# Altium schematic sheet remote.SchDoc
size A
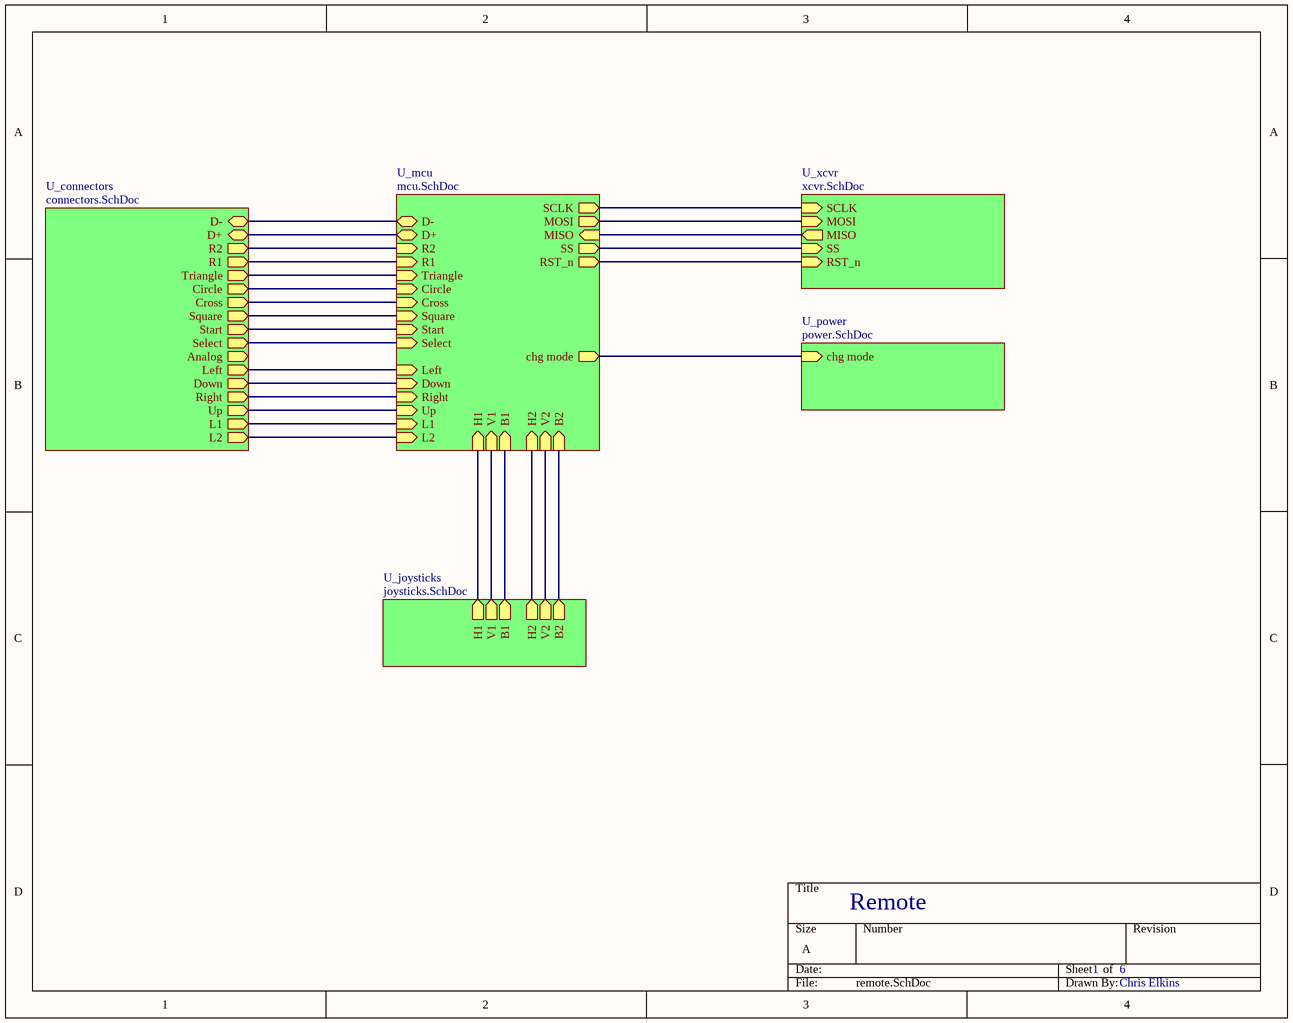
[diagram p0: remote.SchDoc]

## Sub-sheets
U_connectors = connectors.SchDoc: D- (bidir), D+ (bidir), R2, R1, Triangle, Circle, Cross, Square, Start, Select, Analog, Left, Down, Right, Up, L1, L2
U_joysticks = joysticks.SchDoc: H1 (out), V1 (out), B1 (out), H2 (out), V2 (out), B2 (out)
U_mcu = mcu.SchDoc: SCLK (out), MOSI (out), MISO (in), SS (out), D- (bidir), D+ (bidir), chg mode (out), R2 (in), R1 (in), Triangle (in), Circle (in), Cross (in), Square (in), Start (in), Select (in), RST_n (out), Left (in), Down (in), Right (in), Up (in), L1 (in), L2 (in), H1 (in), V1 (in), B1 (in), H2 (in), V2 (in), B2 (in)
U_power = power.SchDoc: chg mode (in)
U_xcvr = xcvr.SchDoc: SCLK (in), MOSI (in), MISO (out), SS (in), RST_n (in)

## Nets
(unnamed): sheet U_connectors/D-, sheet U_mcu/D-
(unnamed): sheet U_connectors/D+, sheet U_mcu/D+
(unnamed): sheet U_connectors/R2, sheet U_mcu/R2
(unnamed): sheet U_connectors/R1, sheet U_mcu/R1
(unnamed): sheet U_connectors/Triangle, sheet U_mcu/Triangle
(unnamed): sheet U_connectors/Circle, sheet U_mcu/Circle
(unnamed): sheet U_connectors/Cross, sheet U_mcu/Cross
(unnamed): sheet U_connectors/Square, sheet U_mcu/Square
(unnamed): sheet U_connectors/Start, sheet U_mcu/Start
(unnamed): sheet U_connectors/Select, sheet U_mcu/Select
(unnamed): sheet U_connectors/Left, sheet U_mcu/Left
(unnamed): sheet U_connectors/Down, sheet U_mcu/Down
(unnamed): sheet U_connectors/Right, sheet U_mcu/Right
(unnamed): sheet U_connectors/Up, sheet U_mcu/Up
(unnamed): sheet U_connectors/L1, sheet U_mcu/L1
(unnamed): sheet U_connectors/L2, sheet U_mcu/L2
(unnamed): sheet U_mcu/SCLK, sheet U_xcvr/SCLK
(unnamed): sheet U_mcu/MOSI, sheet U_xcvr/MOSI
(unnamed): sheet U_mcu/MISO, sheet U_xcvr/MISO
(unnamed): sheet U_mcu/SS, sheet U_xcvr/SS
(unnamed): sheet U_mcu/chg mode, sheet U_power/chg mode
(unnamed): sheet U_mcu/RST_n, sheet U_xcvr/RST_n
(unnamed): sheet U_mcu/H1, sheet U_joysticks/H1
(unnamed): sheet U_mcu/V1, sheet U_joysticks/V1
(unnamed): sheet U_mcu/B1, sheet U_joysticks/B1
(unnamed): sheet U_mcu/H2, sheet U_joysticks/H2
(unnamed): sheet U_mcu/V2, sheet U_joysticks/V2
(unnamed): sheet U_mcu/B2, sheet U_joysticks/B2

## Notes on the sheet
- Remote
- 1
- 6
- Chris Elkins